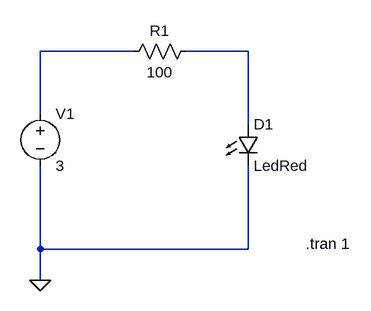
[diagram p0: schematic lab1.asc]
lab1.asc, the LTspice schematic file:
Version 4
SHEET 1 880 680
WIRE 144 16 0 16
WIRE 320 16 224 16
WIRE 0 112 0 16
WIRE 320 128 320 16
WIRE 0 320 0 192
WIRE 320 320 320 192
WIRE 320 320 0 320
WIRE 0 368 0 320
FLAG 0 368 0
SYMBOL voltage 0 96 R0
WINDOW 123 0 0 Left 0
WINDOW 39 0 0 Left 0
SYMATTR InstName V1
SYMATTR Value 3
SYMBOL res 240 0 R90
WINDOW 0 0 56 VBottom 2
WINDOW 3 32 56 VTop 2
SYMATTR InstName R1
SYMATTR Value 100
SYMBOL LED 304 128 R0
SYMATTR InstName D1
SYMATTR Value LedRed
TEXT 408 312 Left 2 !.tran 1

The netlist it stands for:
* lab1.asc
V1 N001 0 3
R1 N002 N001 100
D1 N002 0 LedRed
.model D D
.lib standard.dio
.tran 1
.backanno
.end